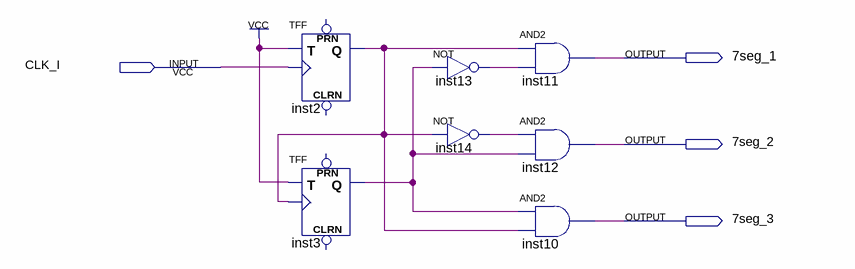
[diagram p0: schematic sheet]
// Quartus schematic seletor_display.bdf as structural Verilog: 7 symbols, 4 pins
module seletor_display (
  input  CLK_I,
  output \7seg_1 ,
  output \7seg_2 ,
  output \7seg_3 
);

  wire inst2_q, inst3_q, inst13_out, inst14_out;

  TFF inst2 (.T(1'b1), .CLK(CLK_I), .Q(inst2_q));  // open: PRN, CLRN
  TFF inst3 (.T(1'b1), .CLK(inst2_q), .Q(inst3_q));  // open: PRN, CLRN
  not inst13 (inst13_out, inst3_q);
  not inst14 (inst14_out, inst2_q);
  and inst11 (\7seg_1 , inst2_q, inst13_out);
  and inst12 (\7seg_2 , inst14_out, inst3_q);
  and inst10 (\7seg_3 , inst3_q, inst2_q);
endmodule
